# EAGLE design 808_rs (EAGLE 7.2.0)
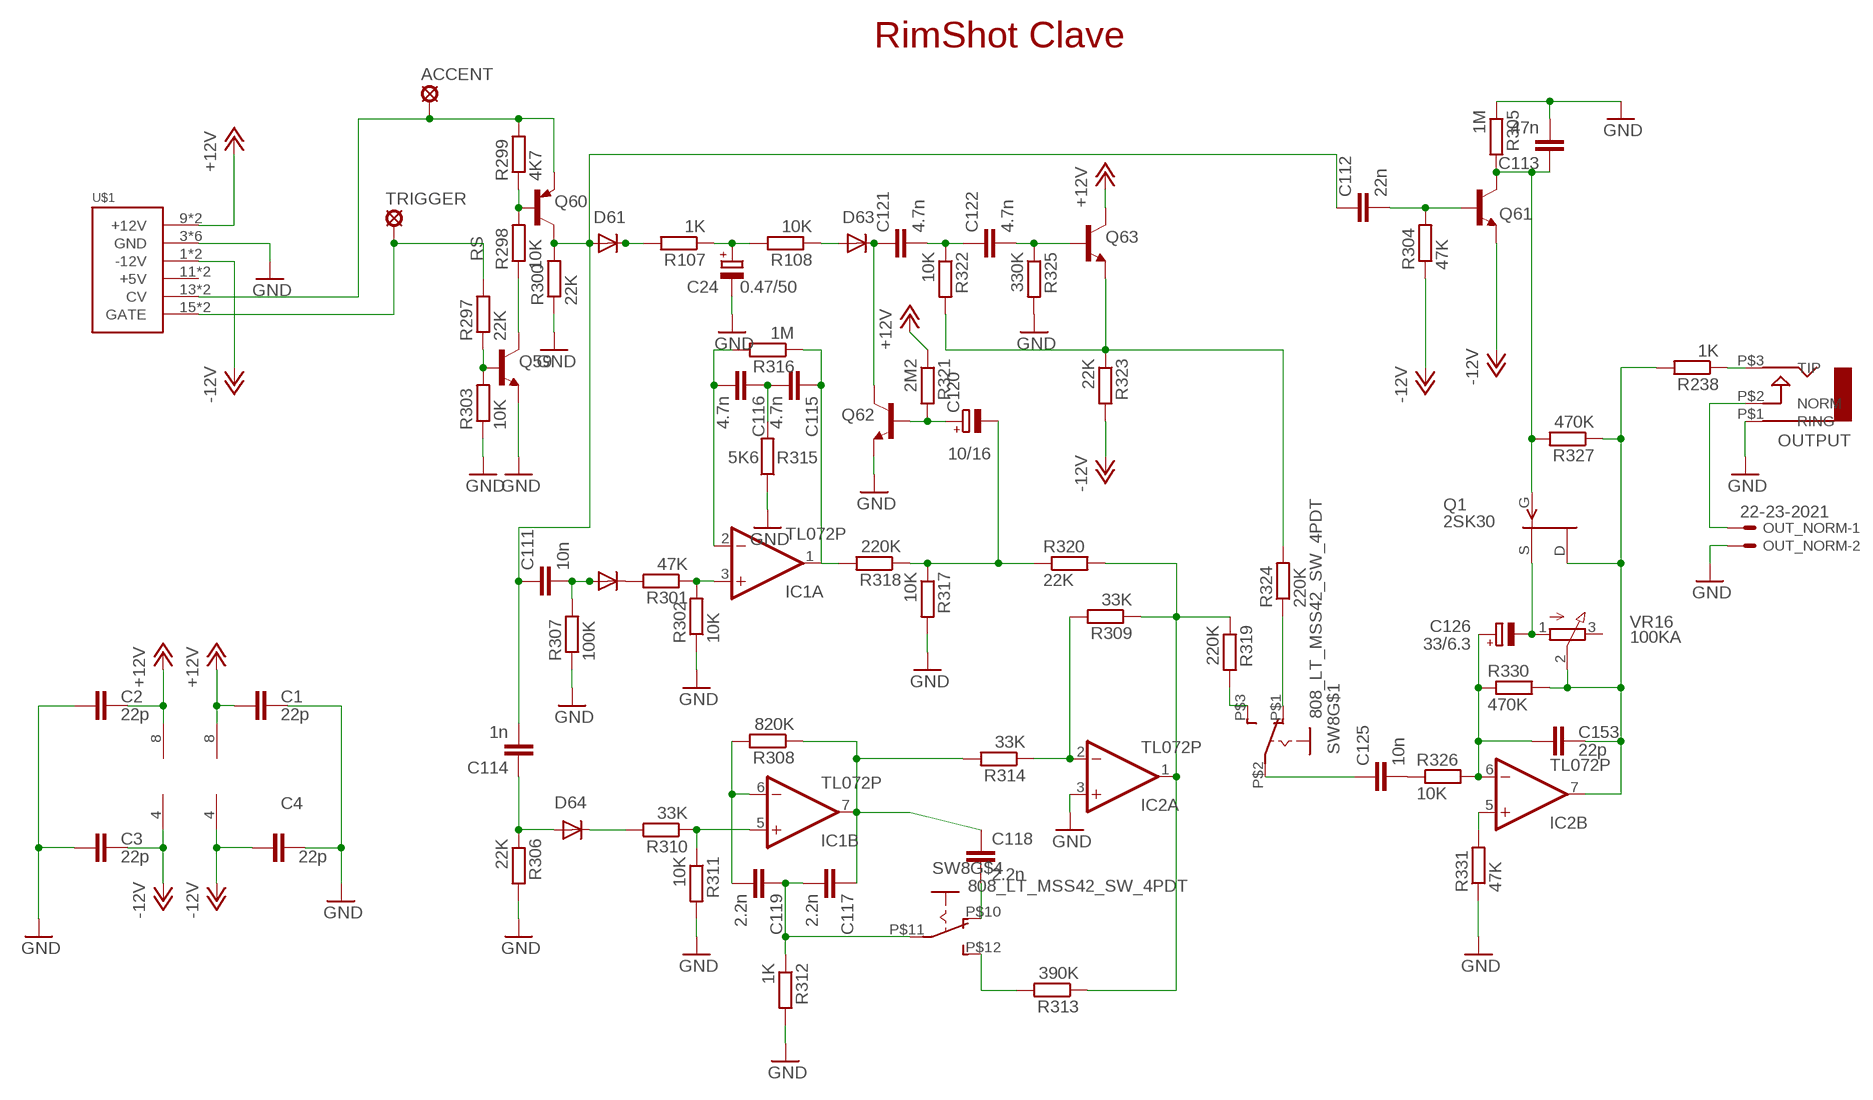
[diagram p0: schematic, sheet 1]

## Parts
ACCENT  LSP11  [LSP11]
C1  22p  C-EU050-024X044  [C050-024X044]
C2  22p  C-EU050-024X044  [C050-024X044]
C3  22p  C-EU050-024X044  [C050-024X044]
C4  22p  C-EU050-024X044  [C050-024X044]
C24  0.47/50  CPOL-EUE2.5-5  [E2,5-5]
C111  10n  C-EU3.5MM_PITCH  [C035-025X75]
C112  22n  C-EU050-025X075  [C050-025X075]
C113  47n  C-EU050-025X075  [C050-025X075]
C114  1n  C-EU050-030X075  [C050-030X075]
C115  4.7n  C-EU3.5MM_PITCH  [C035-025X75]
C116  4.7n  C-EU3.5MM_PITCH  [C035-025X75]
C117  2.2n  C-EU050-024X044  [C050-024X044]
C118  2.2n  C-EU050-025X075  [C050-025X075]
C119  2.2n  C-EU050-024X044  [C050-024X044]
C120  10/16  CPOL-EUE2.5-6  [E2,5-6]
C121  4.7n  C-EU050-025X075  [C050-025X075]
C122  4.7n  C-EU050-030X075  [C050-030X075]
C125  10n  C-EU050-025X075  [C050-025X075]
C126  33/6.3  CPOL-EUE2.5-5  [E2,5-5]
C153  22p  C-EU025-025X050  [C025-025X050]
D61  1N4148DO35-10  [DO35-10]
D62  1N4148DO35-7  [DO35-7]
D63  1N4148DO35-10  [DO35-10]
D64  1N4148DO35-10  [DO35-10]
IC1  TL072P  [DIL08]
IC2  TL072P  [DIL08]
OUT_NORM  22-23-2021  [22-23-2021]
OUTPUT  AUDIO-JACK  [ERTHENVAR-JACK-90DEG]
Q1  2SK30  [TO92]
Q59  2N3904  [TO92]
Q60  2N3906  [TO92]
Q61  2N3904  [TO92]
Q62  2N3904  [TO92]
Q63  2N3904  [TO92]
R107  1K  R-EU_0207/5V  [0207/5V]
R108  10K  R-EU_0207/5V  [0207/5V]
R238  1K  R-EU_0207/7  [0207/7]
R297  22K  R-EU_0207/5V  [0207/5V]
R298  10K  R-EU_0207/5V  [0207/5V]
R299  4K7  R-EU_0207/5V  [0207/5V]
R300  22K  R-EU_0207/5V  [0207/5V]
R301  47K  R-EU_0207/5V  [0207/5V]
R302  10K  R-EU_0207/5V  [0207/5V]
R303  10K  R-EU_0207/2V  [0207/2V]
R304  47K  R-EU_0207/5V  [0207/5V]
R305  1M  R-EU_0207/5V  [0207/5V]
R306  22K  R-EU_0207/7  [0207/7]
R307  100K  R-EU_0207/5V  [0207/5V]
R308  820K  R-EU_0207/5V  [0207/5V]
R309  33K  R-EU_0207/2V  [0207/2V]
R310  33K  R-EU_0207/7  [0207/7]
R311  10K  R-EU_0207/7  [0207/7]
R312  1K  R-EU_0207/5V  [0207/5V]
R313  390K  R-EU_0207/7  [0207/7]
R314  33K  R-EU_0207/7  [0207/7]
R315  5K6  R-EU_0207/5V  [0207/5V]
R316  1M  R-EU_0207/2V  [0207/2V]
R317  10K  R-EU_0207/5V  [0207/5V]
R318  220K  R-EU_0207/5V  [0207/5V]
R319  220K  R-EU_0207/5V  [0207/5V]
R320  22K  R-EU_0207/7  [0207/7]
R321  2M2  R-EU_0207/7  [0207/7]
R322  10K  R-EU_0207/7  [0207/7]
R323  22K  R-EU_0207/5V  [0207/5V]
R324  220K  R-EU_0207/7  [0207/7]
R325  330K  R-EU_0207/7  [0207/7]
R326  10K  R-EU_0309/10  [0309/10]
R327  470K  R-EU_0207/5V  [0207/5V]
R330  470K  R-EU_0207/2V  [0207/2V]
R331  47K  R-EU_0207/7  [0207/7]
SW8  808_LT_MSS42_SW_4PDT  [808_LT_MSS42_SW_SLIDE]
TRIGGER  LSP11  [LSP11]
U$1  POWER  [POWER_16]
VR16  100KA  3RP/1610N  [3RP/1610N]

## Nets
+12V: C1.1 C2.2 IC1.8(P:V+) IC2.8(P:V+) Q63.1(C) R321.1 U$1.9(+12V) U$1.10(+12V)
-12V: C3.2 C4.1 IC1.4(P:V-) IC2.4(P:V-) Q61.3(E) R304.1 R323.2 U$1.1(-12V) U$1.2(-12V)
GND [GND]: C1.2 C2.1 C3.1 C4.2 C24.- C113.2 IC2.3(A:+IN) OUT_NORM.2 OUTPUT.P$1(RING) Q59.3(E) Q62.3(E) R300.1 R302.1 R303.1 R305.1 R306.2 R307.1 R311.2 R312.2 R315.1 R317.2 R325.2 R331.1 U$1.3(GND) U$1.4(GND) U$1.5(GND) U$1.6(GND) U$1.7(GND) U$1.8(GND)
LT_LC_OUT: OUTPUT.P$3(TIP) R238.1
N$1: IC2.5(B:+IN) R331.2
N$2: C125.1 SW8.P$2(P)
N$3: IC2.2(A:-IN) R309.2 R314.1
N$4: C111.P$2 D62.A R307.2
N$5: OUT_NORM.1 OUTPUT.P$2(NORM)
N$6: R324.1 SW8.P$1(O)
N$7: R319.2 SW8.P$3(S)
N$8: C153.2 IC2.7(B:OUT) Q1.1(D) R238.2 R327.1 R330.2 VR16.2(S)
N$161: C113.1 Q1.2(G) Q61.1(C) R305.2 R327.2
N$163: C112.2 Q61.2(B) R304.2
N$165: C118.2 SW8.P$10(O)
N$167: C24.+ R107.1 R108.2
N$172: C121.1 D63.C Q62.1(C)
N$173: C114.1 D64.A R306.1
N$174: C120.+ Q62.2(B) R321.2
N$306 [special]: R313.2 SW8.P$12(S)
N$317: Q60.2(B) R298.2 R299.1
N$318: Q59.2(B) R297.1 R303.2
N$319: Q59.1(C) R298.1
N$324: D61.C R107.2
N$326: D63.A R108.1
N$328: C121.2 C122.1 R322.1
N$329: C122.2 Q63.2(B) R325.1
N$330: Q63.3(E) R322.2 R323.1 R324.2
N$332: D62.C R301.2
N$333: IC1.3(A:+IN) R301.1 R302.2
N$336: D64.C R310.2
N$337: IC1.5(B:+IN) R310.1 R311.1
N$338: C117.2 C119.1 R312.1 SW8.P$11(P)
N$339: C119.2 IC1.6(B:-IN) R308.2
N$340: C117.1 C118.1 IC1.7(B:OUT) R308.1 R314.2
N$344: IC2.1(A:OUT) R309.1 R313.1 R319.1 R320.2
N$347: C125.2 R326.1
N$348: C126.+ C153.1 IC2.6(B:-IN) R326.2 R330.1
N$351: C126.- Q1.3(S) VR16.1(A)
N$352: C115.P$2 C116.P$1 R315.2
N$353: C116.P$2 IC1.2(A:-IN) R316.2
N$354: C115.P$1 IC1.1(A:OUT) R316.1 R318.2
N$355: C120.- R317.1 R318.1 R320.1
N$357: C111.P$1 C112.1 C114.2 D61.A Q60.1(C) R300.2
RS: R297.2 TRIGGER.MP U$1.15(GATE) U$1.16(GATE)
TRIG: ACCENT.MP Q60.3(E) R299.2 U$1.13(CV) U$1.14(CV)
Unconnected: SW8.P$4(O) SW8.P$5(P) SW8.P$6(S) SW8.P$7(O) SW8.P$8(P) SW8.P$9(S) U$1.11(+5V) U$1.12(+5V) VR16.3(E)

## Notes on the sheet
- RimShot Clave

## Library data of the parts
ACCENT TRIGGER = solpad:LSP11: SOLDER PAD drill 1.1 mm
C1-C4 C111-C119 C121 C122 C125 C153 = TR808clone:C-EU: CAPACITOR, European symbol Pitch 3mm
C24 C120 C126 = TR808clone:CPOL-EU: POLARIZED CAPACITOR, European symbol
D61-D64 = TR808clone:1N4148: DIODE high speed (Philips)
IC1 IC2 = linear:TL072: OP AMP
OUT_NORM = con-molex:22-23-2021: .100" (2.54mm) Center Header - 2 Pin; MF: MOLEX; MPN: 22-23-2021; OC_FARNELL: 1462926; OC_NEWARK: 25C3832
OUTPUT = erthenvar:AUDIO-JACK: Switching Mono 3.5mm Audio Jack from Erthenvar.
Q1 = 808:2SK30
Q59 Q61-Q63 = 808_lt:2N3904: NPN Transistor
Q60 = 808_lt:2N3906: PNP Transistor
R107 R108 R238 R297-R327 R330 R331 = TR808clone:R-EU_: RESISTOR, European symbol
SW8 = 808_lt:808_LT_MSS42_SW_4PDT: MSS42 4PDT switch
U$1 = eurorack:POWER
VR16 = pot:3RP/1610N: 16mm Potentiometer one level Source: http://www.alphapotentiometers.net/html/16mm_pot_2.html

## Net classes
0 default: width 0.635 mm, drill 0.254 mm, clearance 0.254 mm
1 GND: width 1.016 mm, drill 1.016 mm, clearance 0.508 mm
2 Power: width 1.016 mm, drill 1.016 mm, clearance 0.508 mm
3 special: width 0.635 mm, drill 0.254 mm, clearance 0.254 mm
4 15v: width 1.524 mm, drill 1.016 mm, clearance 0.508 mm

## Board
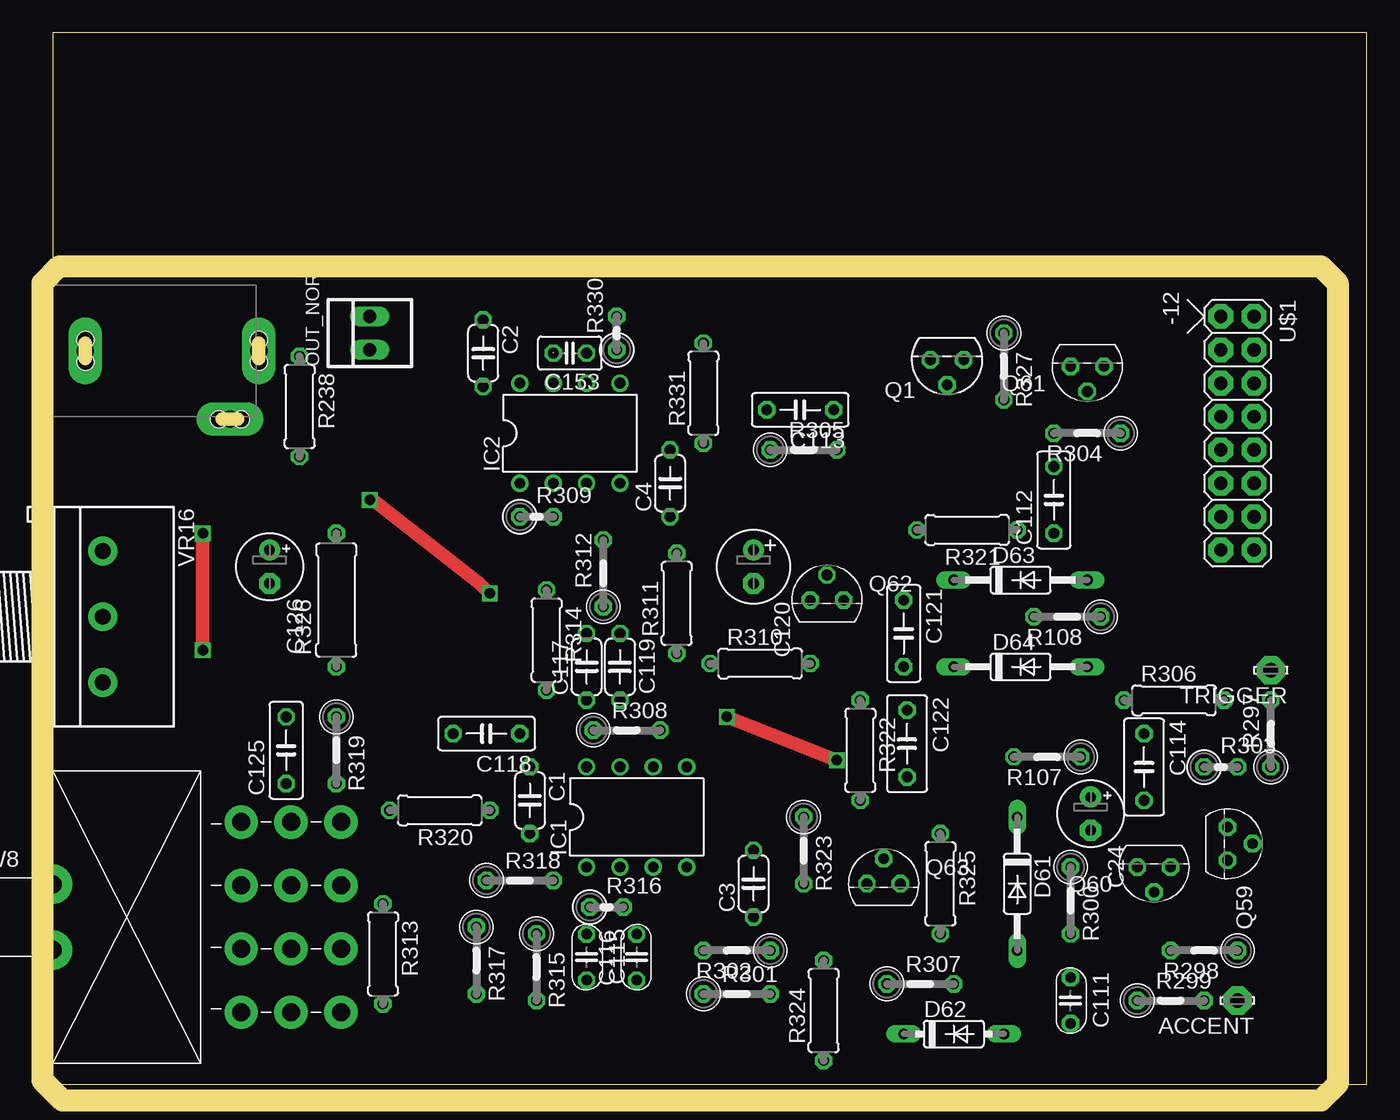
[diagram p1: board, top side]
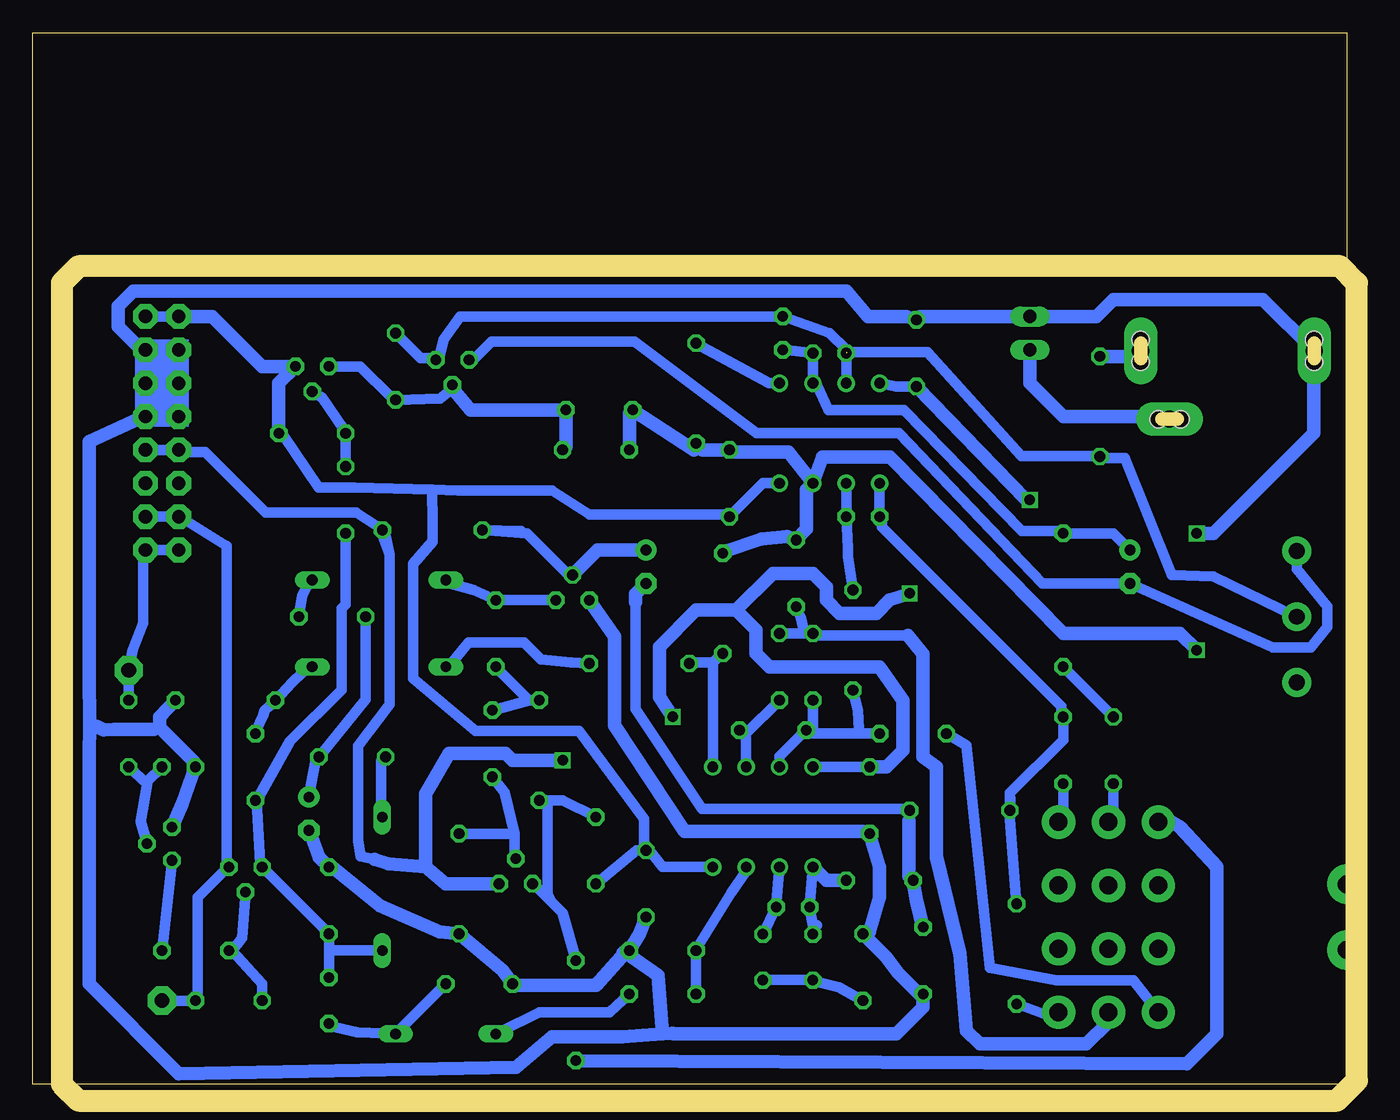
[diagram p2: board, bottom side, seen from below]

Size 100 x 80 mm. Coordinates in mm from the lower left corner, seen from the top.
Outline: 0,0 100,0 100,80 0,80 0,0
Copper layers (1*16): Top 0.035mm / dielectric 1.5mm / Bottom 0.035mm
Design rules "default *": minimum track width 32mil, minimum drill 31mil, track to track 18mil, track to pad 18mil, pad to pad 18mil, via to via 18mil, smd to smd 8mil, copper to edge 0mil, drill to drill 18mil, minimum pad ring 10mil, minimum via ring 8mil, stop-mask expansion 4mil, vias tented up to drill 0mil, thermal gap 10mil
Milling: 8 lines

### Footprints (pad centres in the part's own frame; a part is rotated, then mirrored left to right if it is on the bottom)
LSP11 = drill 1.118 pad 2.159 octagon: MP 0,0
C050-024X044 = drill 0.813 octagon: 1 -2.54,0; 2 2.54,0
E2,5-5 = drill 0.813 pad 1.6: + -1.27,0 | drill 0.813 pad 1.6 octagon: - 1.27,0
C035-025X75 = drill 0.8 octagon: P$1 -1.75,0; P$2 1.75,0
C050-025X075 = drill 0.813 octagon: 1 -2.54,0; 2 2.54,0
C050-030X075 = drill 0.813 octagon: 1 -2.54,0; 2 2.54,0
E2,5-6 = drill 0.813 pad 1.6: + -1.27,0 | drill 0.813 pad 1.6 octagon: - 1.27,0
C025-025X050 = drill 0.813 octagon: 1 -1.27,0; 2 1.27,0
DO35-10 = drill 0.813 long: A 5.08,0; C -5.08,0
DO35-7 = drill 0.813 long: A 3.81,0; C -3.81,0
DIL08 = drill 0.813 pad 1.27: 1 -3.81,-3.81; 2 -1.27,-3.81; 3 1.27,-3.81; 4 3.81,-3.81; 5 3.81,3.81; 6 1.27,3.81; 7 -1.27,3.81; 8 -3.81,3.81
22-23-2021 = drill 1 long: 1 -1.27,0; 2 1.27,0
ERTHENVAR-JACK-90DEG = drill 1.3 pad 2.54 long: P$1 5,-2.5; P$2 -0.2,-13.5; P$3 5,-15.7 | hole 1.3: 5.842,-2.489; 4.14,-2.489; -0.203,-12.649; -0.203,-14.351; 5.842,-15.697; 4.166,-15.697
TO92 = drill 0.813 octagon: 1 -1.27,0; 2 0,1.905; 3 1.27,0
TO92' = drill 0.813 octagon: 1 1.27,0; 2 0,1.905; 3 -1.27,0
0207/5V = drill 0.813 octagon: 1 -2.54,0; 2 2.54,0
0207/7 = drill 0.813 octagon: 1 -3.81,0; 2 3.81,0
0207/2V = drill 0.813 octagon: 1 -1.27,0; 2 1.27,0
0309/10 = drill 0.813 octagon: 1 -5.08,0; 2 5.08,0
808_LT_MSS42_SW_SLIDE = drill 1.372 pad 2.54: P$1 -7.239,14.351; P$2 -7.239,18.151; P$3 -7.239,21.951; P$4 -2.413,14.351; P$5 -2.413,18.151; P$6 -2.413,21.951; P$7 2.413,14.351; P$8 2.413,18.151; P$9 2.413,21.951; P$10 7.239,14.351; P$11 7.239,18.151; P$12 7.239,21.951 | drill 1.372 pad 3: PG$1 2.5,0; PG$2 -2.5,0
POWER_16 = drill 1.016 pad 1.88 octagon: 1 -6.35,-1.27; 2 -6.35,1.27; 3 -3.81,-1.27; 4 -3.81,1.27; 5 -1.27,-1.27; 6 -1.27,1.27; 7 1.27,-1.27; 8 1.27,1.27; 9 3.81,-1.27; 10 3.81,1.27; 11 6.35,-1.27; 12 6.35,1.27; 13 8.89,-1.27; 14 8.89,1.27; 15 11.43,-1.27; 16 11.43,1.27
3RP/1610N = drill 1.2 pad 2.184: 1 -5,0; 2 0,0; 3 5,0

### Placement (x,y rotation side)
ACCENT  90.17,6.35 180 top
C1  36.32,21.59 270 top
C2  32.77,55.63 270 top
C3  53.34,15.24 90 top
C4  46.99,45.72 90 top
C24  78.99,20.57 270 top
C111  77.47,6.35 270 top
C112  76.2,44.45 90 top
C113  56.9,51.31 180 top
C114  83.06,24.13 270 top
C115  40.64,9.65 270 top
C116  44.45,9.65 90 top
C117  40.64,31.75 90 top
C118  33.02,26.67 180 top
C119  43.18,31.75 270 top
C120  53.34,39.37 270 top
C121  64.77,34.29 270 top
C122  65.02,25.91 270 top
C125  17.78,25.4 90 top
C126  16.51,39.37 270 top
C153  39.37,55.63 180 top
D61  73.41,15.24 270 top
D62  68.58,3.81 0 top
D63  73.66,38.35 0 top
D64  73.66,31.75 0 top
IC1  44.45,20.32 0 top
IC2  39.37,49.53 0 top
OUT_NORM  24.13,57.15 90 top
OUTPUT  0,50.8 90 top
Q1  68.07,55.12 180 top
Q59  2N3904  [TO92']  89.41,18.29 270 top
Q60  2N3906  [TO92']  83.82,16.51 180 top
Q61  2N3904  [TO92']  78.74,54.61 180 top
Q62  2N3904  [TO92']  58.93,36.83 0 top
Q63  2N3904  [TO92']  63.25,15.24 0 top
R107  75.69,24.89 180 top
R108  77.22,35.56 180 top
R238  18.8,51.56 270 top
R297  92.71,26.67 90 top
R298  87.63,10.16 180 top
R299  85.09,6.35 0 top
R300  77.47,13.97 270 top
R301  52.07,6.86 0 top
R302  52.07,10.16 180 top
R303  88.9,24.13 0 top
R304  78.74,49.53 180 top
R305  57.15,48.26 0 top
R306  85.34,29.21 0 top
R307  66.04,7.62 0 top
R308  43.69,26.92 0 top
R309  36.83,43.18 0 top
R310  53.85,32 0 top
R311  47.5,36.58 90 top
R312  41.91,38.86 90 top
R313  25.15,9.91 270 top
R314  37.59,33.78 270 top
R315  36.83,8.89 270 top
R316  42.16,13.46 0 top
R317  32.26,9.4 270 top
R318  35.56,15.49 0 top
R319  21.59,25.4 270 top
R320  29.46,20.83 180 top
R321  69.6,42.16 180 top
R322  61.47,25.4 270 top
R323  57.15,17.78 270 top
R324  58.67,5.59 90 top
R325  67.56,15.24 270 top
R326  21.59,36.83 90 top
R327  72.39,54.61 270 top
R330  42.93,57.15 90 top
R331  49.53,52.58 90 top
SW8  0,12.7 270 top
TRIGGER  92.71,31.5 180 top
U$1  90.17,52.07 270 top
VR16  3.81,35.56 270 top

### Tracks (layer width: path | path; a pad name or v marks a point on that pad's centre or on a via)
+12V  (via drill 0.8)
  Top 1.016: v24.13,44.45 24.38,44.45 32.51,38.1 v33.27,37.34 | v51.31,27.94 v59.69,24.64
  Bottom 0.813: U$1.10 U$1.9 88.58,48.1 86.9,48.1 82.3,43.5 75.41,43.5 73.25,42.1 72.83,40.26 | 74.01,17.08 75.06,17.34 75.25,18.54 75.25,25.72 72.83,28.89 72.83,40.26 | 72.83,40.26 73.47,41.91 R321.1 | IC1.8 C1.1 | C2.2 34.29,53.09 IC2.8
  Bottom 1.016: C1.1 35.05,24.13 33.78,25.4 33.78,29.21 35.56,31.75 43.94,31.75 44.96,32.77 44.96,34.54 46.48,36.07 | v24.13,44.45 24.38,44.45 C2.2 | 46.48,36.07 49.53,36.07 52.32,33.27 52.32,29.46 v51.31,27.94 | Q63.1 68.58,15.24 70.1,16.51 | 70.1,16.51 70.1,22.1 68.33,25.15 64.01,25.15 63.5,24.64 v59.69,24.64 | 70.1,16.51 72.93,16.76 74.01,17.08 | v33.27,37.34 34.8,36.83 35.81,35.81 38.61,35.81 39.62,36.83 39.62,37.85 40.64,38.86 43.69,38.86 46.48,36.07
-12V
  Bottom 0.813: IC1.4 52.07,16.51 53.07,17.76 | 53.07,17.76 C3.2 53.5,18.1 53.5,20.16 58.42,26.86 66.29,26.86 71.06,30.86 71.06,39.56 69.6,41.27 69.6,42.7 69.61,45.26 | R323.2 54.07,17.78 53.07,17.76 | IC2.4 44.45,45.72 C4.1 47.31,43.34 57.63,43.34 60.48,45.18 67.66,45.18 69.61,45.26 | U$1.2 U$1.1 88.58,58.26 | 69.61,45.26 75.56,45.4 78.26,45.4 80.96,49.37 R304.1
  Bottom 1.016: U$1.1 86.36,58.42 82.55,54.61 Q61.3 81.28,53.34 R304.1
GND  (via drill 0.8)
  Top 1.016: v11.43,33.02 v11.43,41.91
  Bottom 1.016: C24.- 78.93,19.21 78.23,17.24 R300.1 76.99,16.35 73.56,13.56 69.06,11.59 R325.2 64.26,8.64 R307.1 63.02,7.53 57.15,7.53 54.93,10 55.09,10 R302.1 | C3.1 53.85,11.43 R302.1 | IC2.3 41.12,45.24 41.12,42.23 R312.2 42.61,41.66 44.55,41.5 47.47,40.48 R311.2 | IC2.3 42.51,48.1 46.51,48.1 C4.2 49.05,48.26 49.53,48.74 R331.1 49.69,48.26 C113.2 54.61,51.05 R305.1 | Q62.3 55.72,34.07 55.72,27.3 50.42,19.21 36.83,19.21 C1.2 36.35,19.05 35.59,16.54 35.56,14.22 36.35,11.59 R315.1 35.08,9.68 34.13,8.41 32.58,6.86 R317.2 32.26,5.84 34.29,3.81 51.28,3.81 51.34,3.87 52.07,3.84 | IC2.3 39.91,47.72 34.77,47.72 21.59,34.29 12.7,34.29 v11.43,33.02 | 52.07,3.84 52.42,8.26 54.45,9.68 R302.1 | Q59.3 88.65,21.34 R303.1 87.79,24.61 90.33,27.15 | 90.33,27.15 90.33,27.94 R306.2 | U$1.5 U$1.7 U$1.8 91.92,50.64 95.69,48.9 95.69,31.59 95.66,26.99 | U$1.5 U$1.6 | U$1.5 U$1.3 U$1.4 91.92,56.04 93.5,57.63 93.5,59.21 92.36,60.36 38.07,60.36 36.45,58.42 33.53,58.42 C2.1 32.51,58.42 OUT_NORM.2 19.05,58.42 17.78,59.69 6.39,59.69 OUTPUT.P$1 2.54,55.76 2.54,49.53 10.16,41.91 v11.43,41.91 | 95.66,26.99 95.12,27.21 94.61,26.96 93.82,26.99 90.81,26.99 90.33,27.15 | 52.07,3.84 55.12,3.59 60.48,3.59 63.25,1.27 88.9,0.79 95.73,7.62 95.73,25.4 95.66,26.99
LT_LC_OUT
  Bottom 1.016: R238.1 16.13,55.37 OUTPUT.P$3
N$1
  Bottom 0.813: IC2.5 43.97,53.34 49.53,56.36 R331.2
N$2
  Bottom 0.813: C125.1 17.78,20.32 18.1,20 SW8.P$2
N$3
  Bottom 0.813: R314.1 37.97,40.13 37.97,40.77 R309.2 IC2.2
N$4
  Bottom 0.813: C111.P$2 77.47,4.45 75.31,3.94 D62.A R307.2
N$5
  Bottom 1.016: OUT_NORM.1 24.13,53.34 21.59,50.8 13.7,50.8 OUTPUT.P$2
N$6
  Bottom 1.016: R324.1 12.19,1.52 9.91,3.81 9.91,16.51 12.7,19.56 13.97,20.32 SW8.P$1
N$7
  Bottom 0.813: R319.2 21.59,20.32 21.91,20 SW8.P$3
N$8  (1 unrouted)
  Bottom 0.813: R327.1 70.48,55.24 69.37,55.24 Q1.1 69.06,55.4 68.74,56.67 67.5,58.42 R330.2 39.37,57.15 38.1,55.88 38.1,55.69 | 38.1,55.69 IC2.7 | VR16.2 10.16,38.61 13.34,38.73 16.89,47.62 18.73,47.62 R238.2 19.21,47.78 24.77,47.78 31.91,55.69 38.1,55.69
N$161
  Bottom 0.813: Q61.1 75.09,54.61 72.71,52.23 R327.2 68.99,52.16 68.07,52.93 68.1,53.18 Q1.2 67.79,52.99
  Bottom 1.016: R305.2 59.44,48.51 C113.1 66.71,51.31 68.07,52.93
N$163
  Bottom 0.813: C112.2 R304.2 76.36,49.85 77.98,52.23 Q61.2
N$165
  Bottom 0.813: C118.2 28.96,25.78 27.18,8.86 22.13,7.87 16.26,7.87 SW8.P$10
N$167
  Bottom 0.813: C24.+ 78.49,24.64 R107.1 74.68,29.27 R108.2
N$172
  Bottom 0.813: 68.58,38.42 D63.C 68.26,38.1 66.45,37.59 65.09,36.99 C121.1 Q62.1
N$173
  Bottom 0.813: C114.1 83,26.92 82.49,28.07 82.36,28.45 R306.1 80.26,30.54 79.47,31.34 79.06,31.59 D64.A
N$174
  Bottom 0.813: Q62.2 59.24,38.89 59.37,38.89 62.39,41.91 R321.2 62.87,42.07
  Bottom 1.016: C120.+ 57.02,40.64 Q62.2
N$306
  Bottom 0.813: R313.2 22.38,5.08 22.07,5.4 SW8.P$12
N$317
  Bottom 0.813: R299.1 82.55,7.62 84.82,10.14 | R298.2 84.82,10.14 | Q60.2 84.07,11.14 84.82,10.14
N$318
  Bottom 0.813: 91.28,22.86 91.28,23.02 R303.2 | 91.28,22.86 91.79,20 Q59.2 | 91.28,22.86 R297.1
N$319
  Bottom 0.813: Q59.1 R298.1
N$324
  Bottom 0.813: D61.C 73.5,20.64 73.5,24.61 73.22,24.89 R107.2
N$326
  Bottom 0.813: 78.74,38.42 D63.A 79.06,38.1 79.5,37.15 R108.1
N$328
  Bottom 0.813: 62.23,29.21 R322.1 | C122.1 62.23,29.21 | 62.23,29.21 C121.2
N$329
  Bottom 0.813: 63.34,19.05 64.1,22.19 C122.2 | 63.34,19.05 63.34,17.14 Q63.2 | 63.34,19.05 R325.1
N$330
  Bottom 0.813: R323.1 59.69,21.59 R322.2 60.83,21.53 60.83,14.38 60.56,13.89 | R324.2 59.69,13.02 60.56,13.89 | 60.56,13.89 61.91,15.24 Q63.3
N$332
  Bottom 0.813: R301.2 56.13,5.46 61.44,5.46 64.45,3.97 D62.C
N$333
  Bottom 0.813: R301.1 R302.2 49.37,10.48 46.83,14.57 45.72,16.19 IC1.3
N$336
  Bottom 0.813: R310.2 59.05,32.07 61.34,32.32 62.61,33.59 66.83,33.59 68.26,31.91 D64.C
N$337
  Bottom 0.813: 48.26,32.07 IC1.5 | 48.26,32.07 47.62,32.7 R311.1 | 48.26,32.07 50.01,32.07 R310.1
N$338
  Bottom 0.813: C119.1 41.27,34.29 | 41.27,34.29 C117.2 40.32,34.13 33.4,34.13 | 41.27,34.29 41.53,35.47 R312.1 | 18.1,5.4 SW8.P$11
  Bottom 1.016: SW8.P$11 18.15,4.71 19.81,3.05 27.94,3.05 28.96,4.06 29.46,9.91 31.24,17.27 31.24,24.13 32.26,24.89 32.26,32.73 33.4,34.13
N$339
  Bottom 0.813: IC1.6 45.72,26.35 46.2,26.83 R308.2 45.72,26.67 C119.2
N$340
  Bottom 0.813: IC1.7 43.18,24.92 41.27,26.83 R308.1 | 37.15,26.67 40.96,26.67 R308.1 | 37.15,26.67 C118.1 | C117.1 40.64,26.99 R308.1 | R314.2 37.21,28.45 37.15,26.99 37.15,26.67
N$344
  Bottom 0.813: IC2.1 R309.1 35.4,42.86 35.4,42.39 21.75,28.73 21.75,28.26 R319.1 21.59,26.19 25.64,22.15 | 25.64,22.15 25.56,20.95 R320.2 | R313.1 25.65,20.13 25.64,22.15
N$347
  Bottom 0.813: R326.1 C125.2
N$348
  Bottom 0.813: R330.1 C153.1 IC2.6 40.32,53.18 39.47,51.31 33.72,51.31 24.73,42.07 21.91,42.07 R326.2 17.78,41.91 C126.+
N$351
  Bottom 0.813: Q1.3 66.67,55.24 66.36,55.24 65.09,56.52 54.2,56.52 44.93,49.53 34.1,49.53 23.18,38.1 C126.- 16.19,37.94 5.65,33.24 2.76,33.24 1.49,34.77 1.49,36.35 3.81,39.18 VR16.1
N$352
  Bottom 0.813: C116.P$1 44.45,7.94 40.64,7.94 C115.P$2 40.32,7.78 38.64,7.37 R315.2
N$353
  Bottom 0.813: C116.P$2 R316.2 IC1.2
N$354
  Bottom 0.813: 40.64,12.06 R316.1 IC1.1 | 40.64,12.06 C115.P$1 | 40.32,12.06 40.64,12.06
  Bottom 1.016: R318.2 39.62,15.49 IC1.1
N$355
  Bottom 0.813: 33.34,20.03 R320.1 33.4,20.95 49.09,20.95 54.13,28.54 54.13,36.67
  Bottom 1.016: 54.13,36.67 54.13,37.31 C120.- | 33.34,20.03 33.34,15.81 R318.1 32.77,13.97 R317.1
N$357
  Bottom 0.813: 77.47,10.16 R300.2 Q60.1 82.71,16.83 82.96,21.56 80.41,26.11 | 77.47,10.16 C111.P$1 | 77.47,10.16 D61.A | C112.1 76.2,36.51 76.52,36.2 76.52,30 80.41,26.11 | 80.41,26.11 82.74,22 82.74,21.84 C114.2
RS
  Bottom 0.813: U$1.15 U$1.16 91.6,40.32 91.6,35.08 92.39,33.02 TRIGGER.MP R297.2
TRIG
  Bottom 0.813: U$1.14 U$1.13 88.58,43.02 85.25,40.96 85.25,16.83 Q60.3 85.09,16.57 87.47,14.19 87.47,6.67 R299.2 ACCENT.MP
(copper drawn outside any net)
  shapes: Bottom area x1